# Altium schematic sheet CAN.SchDoc
size A; SheetNumber: 4; SheetTotal: 5
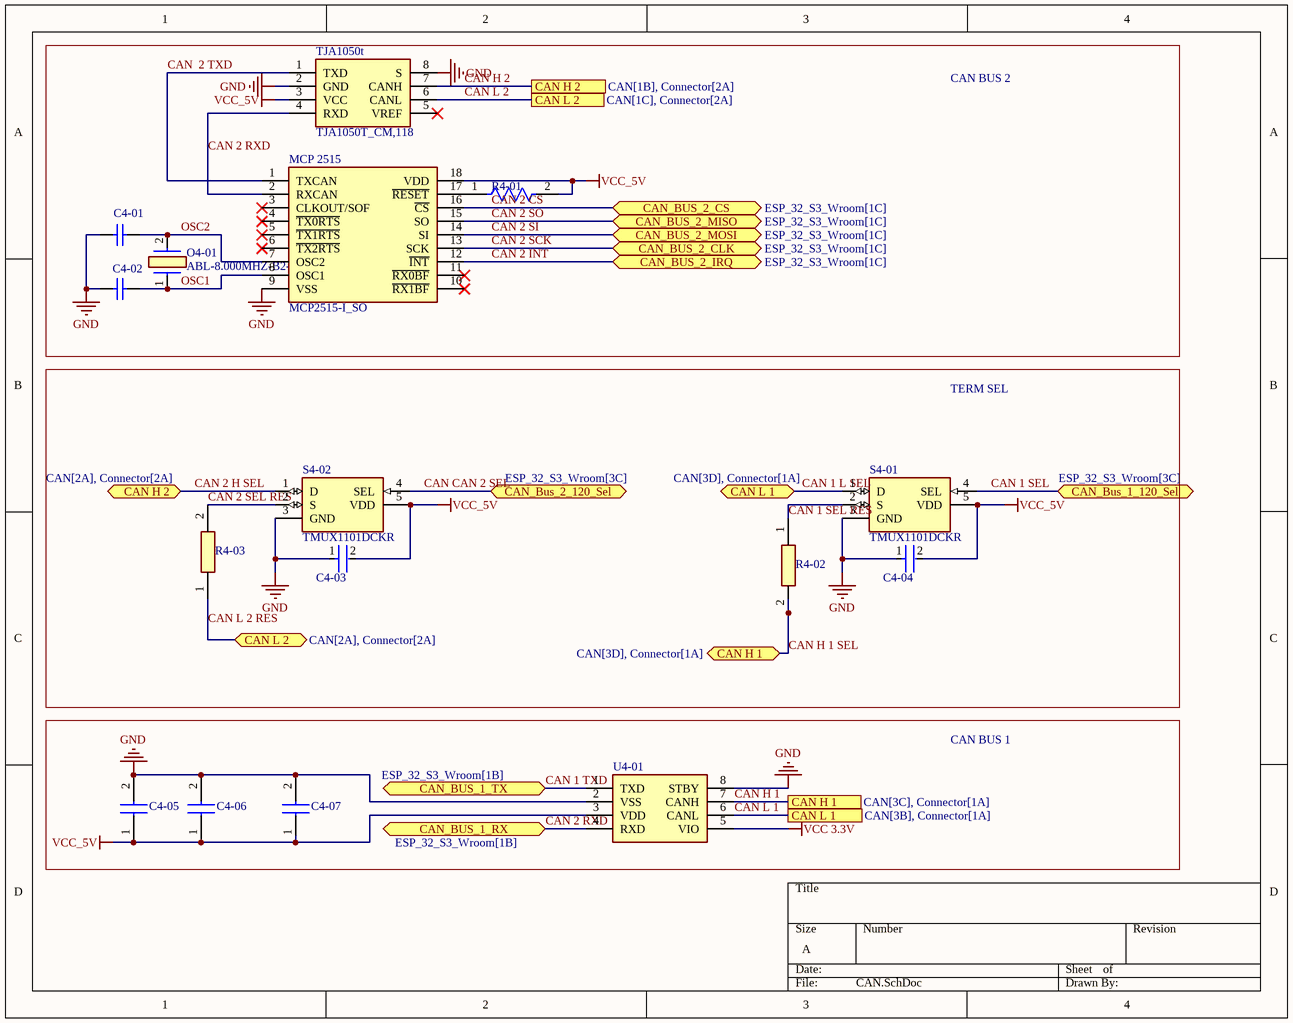
[diagram p0: CAN.SchDoc]

## Parts
C4-01  GRM1555C1H220JA01D  [CAPC1005X55X25NL05T10]  (value not drawn)
C4-02  GRM1555C1H220JA01D  [CAPC1005X55X25NL05T10]  (value not drawn)
C4-03  GCJ21BR71H105KA01L  [FP-GCJ21B-0_3-IPC_B]  (value not drawn)
C4-04  GCJ21BR71H105KA01L  [FP-GCJ21B-0_3-IPC_B]  (value not drawn)
C4-05  CL21A226MAYNNNE  [CAPC2012X145N]  (value not drawn)
C4-06  CL21A226MAYNNNE  [CAPC2012X145N]  (value not drawn)
C4-07  .1uF  [CAPC2012X95N]  (value not drawn)
MCP_2515  MCP2515-I_SO  [SOIC127P1030X265-18N]
O4-01  ABL-8.000MHZ-B2-T  [ABL]
R4-01  RC0603FR-0710KL  [FP-RC0603-0_55-IPC_C]  (value not drawn)
R4-02  RC0603FR-07120RL  [RESC1608X55N]  (value not drawn)
R4-03  RC0603FR-07120RL  [RESC1608X55N]  (value not drawn)
S4-01  TMUX1101DCKR  [SOT65P210X110-5N]
S4-02  TMUX1101DCKR  [SOT65P210X110-5N]
TJA1050t  TJA1050T_CM,118  [SOIC127P600X175-8N]
U4-01  MCP2562FD-H_SN  [SOIC127P600X175-8N]  (value not drawn)

## Blocks framed on the sheet
CAN BUS 2: C4-01 C4-02 MCP_2515 O4-01 R4-01 TJA1050t
TERM SEL: C4-03 C4-04 R4-02 R4-03 S4-01 S4-02
CAN BUS 1: C4-05 C4-06 C4-07 U4-01

## Ports
CAN H 1 (bidir, see CAN[3D], Connector[1A]), CAN H 1 (see CAN[3C], Connector[1A]), CAN H 2 (bidir, see CAN[2A], Connector[2A]), CAN H 2 (see CAN[1B], Connector[2A]), CAN L 1 (bidir, see CAN[3D], Connector[1A]), CAN L 1 (see CAN[3B], Connector[1A]), CAN L 2 (bidir, see CAN[2A], Connector[2A]), CAN L 2 (see CAN[1C], Connector[2A]), CAN_Bus_1_120_Sel (bidir, see ESP_32_S3_Wroom[3C]), CAN_BUS_1_RX (bidir, see ESP_32_S3_Wroom[1B]), CAN_BUS_1_TX (bidir, see ESP_32_S3_Wroom[1B]), CAN_Bus_2_120_Sel (bidir, see ESP_32_S3_Wroom[3C]), CAN_BUS_2_CLK (bidir, see ESP_32_S3_Wroom[1C]), CAN_BUS_2_CS (bidir, see ESP_32_S3_Wroom[1C]), CAN_BUS_2_IRQ (bidir, see ESP_32_S3_Wroom[1C]), CAN_BUS_2_MISO (bidir, see ESP_32_S3_Wroom[1C]), CAN_BUS_2_MOSI (bidir, see ESP_32_S3_Wroom[1C])

## Nets
GND: C4-01.1 C4-02.1 C4-03.1 C4-04.1 C4-05.2 C4-06.2 C4-07.2 MCP_2515.9(VSS) S4-01.3(GND) S4-02.3(GND) TJA1050t.2(GND) TJA1050t.8(S) U4-01.2(VSS) U4-01.8(STBY)
VCC 3.3V: U4-01.5(VIO)
VCC_5V: C4-03.2 C4-04.2 C4-05.1 C4-06.1 C4-07.1 MCP_2515.18(VDD) R4-01.2 S4-01.5(VDD) S4-02.5(VDD) TJA1050t.3(VCC) U4-01.3(VDD)
CAN 1 L SEL: S4-01.1(D) U4-01.6(CANL) ; port CAN L 1  [also labelled CAN L 1]
CAN 1 SEL: S4-01.4(SEL) ; port CAN_Bus_1_120_Sel
CAN 1 SEL RES: R4-02.1 S4-01.2(S)
CAN 1 TXD: U4-01.1(TXD) ; port CAN_BUS_1_TX
CAN 2 CS: MCP_2515.16(~{CS}) ; port CAN_BUS_2_CS
CAN 2 H SEL: S4-02.1(D) TJA1050t.7(CANH) ; port CAN H 2  [also labelled CAN H 2]
CAN 2 INT: MCP_2515.12(~{INT}) ; port CAN_BUS_2_IRQ
CAN 2 RXD: MCP_2515.2(RXCAN) TJA1050t.4(RXD) U4-01.4(RXD) ; port CAN_BUS_1_RX
CAN 2 SCK: MCP_2515.13(SCK) ; port CAN_BUS_2_CLK
CAN 2 SEL RES: R4-03.2 S4-02.2(S)
CAN 2 SI: MCP_2515.14(SI) ; port CAN_BUS_2_MOSI
CAN 2 SO : MCP_2515.15(SO) ; port CAN_BUS_2_MISO
CAN  2 TXD: MCP_2515.1(TXCAN) TJA1050t.1(TXD)
CAN CAN 2 SEL: S4-02.4(SEL) ; port CAN_Bus_2_120_Sel
CAN H 1: R4-02.2 U4-01.7(CANH) ; port CAN H 1  [also labelled CAN H 1 SEL]
CAN L 2: R4-03.1 TJA1050t.6(CANL) ; port CAN L 2  [also labelled CAN L 2 RES]
OSC1: C4-02.2 MCP_2515.8(OSC1) O4-01.1
OSC2: C4-01.2 MCP_2515.7(OSC2) O4-01.2
NetMCP_2515_17: MCP_2515.17(~{RESET}) R4-01.1

Not connected (* = marked no-connect by the designer): MCP_2515 3(CLKOUT/SOF)* 4(~{TX0RTS})* 5(~{TX1RTS})* 6(~{TX2RTS})* 10(~{RX1BF})* 11(~{RX0BF})*; TJA1050t 5(VREF)*

## Library data of the parts
C4-01 C4-02 = CMP-2008-04302-1: Manufacturer: Murata; Part Number: GRM1555C1H220JA01D
C4-03 C4-04 = CMP-06035-043290-1: Multilayer Ceramic Capacitors MLCC - SMD/SMT 0805 1uF 10%, 50VDC,  X7R 15%; Voltage Rating (DC): 50V; Max Operating Temperature: 125°C; Ratings: AEC-Q200; Height: 1.25mm; Lead Free: Lead Free; Weight: 0.000335oz; Thickness: 0.057inch; Min Operating Temperature: -55°C; Termination: SMD/SMT; Features: Soft Termination; Mount: Surface Mount; Voltage Rating: 50V; Case Code (Imperial): 0805; Package Quantity: 3000; Tolerance: 10%; Width: 0.049inch; Case/Package: 0805; Capacitance: 1uF; Case Code (Metric): 2012; Dielectric: X7R; Packaging: Tape and Reel; Length: 0.079inch
C4-05 C4-06 = CL21A226MAYNNNE: Capacitor; Manufacturer_Name: SAMSUNG; Datasheet Link: http://product.samsungsem.com/mlcc/CL21A226MAYNNN.do; Height: 1.45mm; Manufacturer_Part_Number: CL21A226MAYNNNE; Mouser Part Number: 187-CL21A226MAYNNNE; Mouser Price/Stock: https://www.mouser.co.uk/ProductDetail/Samsung-Electro-Mechanics/CL21A226MAYNNNE?qs=xZ%2FP%252Ba9zWqY%2FVvCfXjMhqg%3D%3D; Arrow Part Number: CL21A226MAYNNNE; Arrow Price/Stock: https://www.arrow.com/en/products/cl21a226maynnne/samsung-electro-mechanics?utm_currency=USD&region=nac
C4-07 = CL21B104KBCNNNC: Capacitor; Manufacturer_Name: SAMSUNG; Datasheet Link: https://datasheet.datasheetarchive.com/originals/distributors/Datasheets_SAMA/86a3eaf0882763ef32124d5901f9b833.pdf; Height: 0.95mm; Manufacturer_Part_Number: CL21B104KBCNNNC; Mouser Part Number: 187-CL21B104KBCNNNC; Mouser Price/Stock: https://www.mouser.co.uk/ProductDetail/Samsung-Electro-Mechanics/CL21B104KBCNNNC?qs=349EhDEZ59pEfpnm5yBEmQ%3D%3D; Arrow Part Number: CL21B104KBCNNNC; Arrow Price/Stock: https://www.arrow.com/en/products/cl21b104kbcnnnc/samsung-electro-mechanics?region=europe
MCP_2515 = CMP-031-00010-1: Integrated Circuit; Manufacturer_Part_Number: MCP2515-I/SO; Manufacturer_Name: Microchip; Arrow Part Number: MCP2515-I/SO; Design Item ID: MCP2515-I_SO; Source: SamacSys.SchLib; Arrow Price/Stock: https://www.arrow.com/en/products/mcp2515-iso/microchip-technology?utm_currency=USD&region=europe; Mouser Part Number: 579-MCP2515-I/SO; Height: 2.65mm; Mouser Price/Stock: https://www.mouser.co.uk/ProductDetail/Microchip-Technology/MCP2515-I-SO?qs=KwArPi4cUogGDbGnphOvtQ%3D%3D; Datasheet Link: https://datasheet.datasheetarchive.com/originals/distributors/Datasheets-34/DSA-675138.pdf
O4-01 = CMP-003-00000-1: Crystal or Oscillator; Manufacturer_Name: ABRACON; Mouser Price/Stock: https://www.mouser.co.uk/ProductDetail/ABRACON/ABL-8.000MHZ-B2-T?qs=vmHwEFxEFR9sZytdVtTZBg%3D%3D; Source: SamacSys.SchLib; Mouser Part Number: 815-ABL8000MHZB2T; Design Item ID: ABL-8.000MHZ-B2-T; Manufacturer_Part_Number: ABL-8.000MHZ-B2-T; Datasheet Link: https://abracon.com/Resonators/ABL.pdf
R4-01 = CMP-2100-03664-2: RES 10K OHM 1% 1/10W 0603; Voltage Rating: 75V; Voltage Rating (DC): 50V; Resistance: 10kR; Power Rating: 100mW; Temperature Coefficient: 100ppm/°C; Depth: 0.8mm; Termination: SMD/SMT; Resistor Type: Thick Film; Series: RC; Construction: Rectangular; Features: Moisture Resistant; Packaging: Tape and Reel; Min Operating Temperature: -55°C; Number of Terminations: 2; Lead Pitch: 0.3mm; RoHS Compliant: Yes; Case/Package: 0603; Resistance Tolerance: 1%; Military Standard: Not; Weight: 7.1E-05oz; Number of Pins: 2; Tolerance: 1%; Length: 1.6mm; Case Code (Imperial): 0603; Lead Free: Lead Free; Width: 0.8mm; Max Power Dissipation: 100mW; Height: 0.45mm; Max Operating Temperature: 155°C; Case Code (Metric): 1608; Size Code: 0603
R4-02 R4-03 = CMP-009-00003-1: Resistor; Manufacturer_Name: KEMET; Mouser Part Number: 603-RC0603FR-07120RL; Design Item ID: RC0603FR-07120RL; Arrow Price/Stock: https://www.arrow.com/en/products/rc0603fr-07120rl/yageo; Source: SamacSys.SchLib; Datasheet Link: http://www.yageo.com/documents/recent/PYu-RC0603_51_RoHS_L_v5.pdf; Manufacturer_Part_Number: RC0603FR-07120RL; Arrow Part Number: RC0603FR-07120RL; Mouser Price/Stock: https://www.mouser.co.uk/ProductDetail/Yageo/RC0603FR-07120RL?qs=uM1JSSdPjOCKJQFXEGGb5w%3D%3D; Height: 0.55mm
S4-01 S4-02 = CMP-011-00000-1: Switch; Manufacturer_Name: Texas Instruments; Mouser Price/Stock: https://www.mouser.co.uk/ProductDetail/Texas-Instruments/TMUX1101DCKR?qs=vLWxofP3U2x5rBu7DSMCxw%3D%3D; Design Item ID: TMUX1101DCKR; Height: 1.1mm; Mouser Part Number: 595-TMUX1101DCKR; Arrow Price/Stock: https://www.arrow.com/en/products/tmux1101dckr/texas-instruments?utm_currency=USD&region=nac; Manufacturer_Part_Number: TMUX1101DCKR; Arrow Part Number: TMUX1101DCKR; Datasheet Link: http://www.ti.com/lit/gpn/TMUX1101; Source: SamacSys.SchLib
TJA1050t = CMP-031-00014-1: Integrated Circuit; Manufacturer_Name: NXP; Manufacturer_Part_Number: TJA1050T/CM,118; Arrow Part Number: TJA1050T/CM,118; Mouser Price/Stock: https://www.mouser.co.uk/ProductDetail/NXP-Semiconductors/TJA1050T-CM118?qs=5XOdhvmYM0NFFspw0VP5sA%3D%3D; Height: 1.75mm; Mouser Part Number: 771-TJA1050T/CM118; Arrow Price/Stock: https://www.arrow.com/en/products/tja1050tcm118/nxp-semiconductors?utm_currency=USD&region=europe; Datasheet Link: http://www.nxp.com/docs/en/data-sheet/TJA1050.pdf; Source: SamacSys.SchLib; Design Item ID: TJA1050T_CM,118
U4-01 = MCP2562FD-H_SN: Integrated Circuit; Manufacturer_Name: Microchip; Manufacturer_Part_Number: MCP2562FD-H/SN; Datasheet Link: http://www.microchip.com/mymicrochip/filehandler.aspx?ddocname=en568915; Height: 1.75mm; Mouser Part Number: 579-MCP2562FD-H/SN; Mouser Price/Stock: https://www.mouser.co.uk/ProductDetail/Microchip-Technology/MCP2562FD-H-SN?qs=YlpJWyuQ3POk3KZHoNA6vA%3D%3D; Arrow Part Number: MCP2562FD-H/SN; Arrow Price/Stock: https://www.arrow.com/en/products/mcp2562fd-hsn/microchip-technology?region=nac